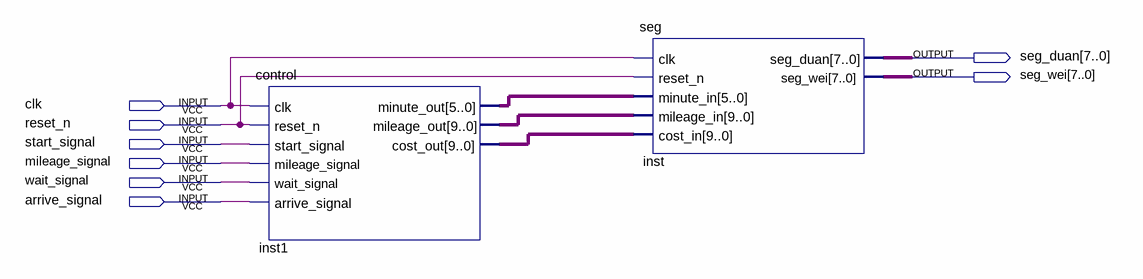
[diagram p0: schematic sheet]
// Quartus schematic Block1.bdf as structural Verilog: 2 symbols, 8 pins
module Block1 (
  input  clk,
  input  reset_n,
  input  start_signal,
  input  mileage_signal,
  input  wait_signal,
  input  arrive_signal,
  output [7:0] seg_duan,
  output [7:0] seg_wei
);

  wire [5:0] inst1_minute_out;
  wire [9:0] inst1_cost_out, inst1_mileage_out;

  control inst1 (
    .clk(clk), .reset_n(reset_n), .start_signal(start_signal), .mileage_signal(mileage_signal),
    .wait_signal(wait_signal), .arrive_signal(arrive_signal), .minute_out(inst1_minute_out),
    .mileage_out(inst1_mileage_out), .cost_out(inst1_cost_out));
  seg inst (
    .clk(clk), .reset_n(reset_n), .minute_in(inst1_minute_out), .mileage_in(inst1_mileage_out),
    .cost_in(inst1_cost_out), .seg_duan(seg_duan), .seg_wei(seg_wei));
endmodule
